# Altium schematic sheet Main.SchDoc
size A4; SheetNumber: 1; SheetTotal: 3; SPICEModelCacheVUBOQJVG: <root> / <DocumentId>VUBOQJVG</DocumentId> / <CacheFrame Number="0"> / <Model Name="led1" Kind="MDL"> / <Text>*Typ RED GaAs LED: Vf=1.7V Vr=4V If=40mA trr=3uS / *LED Pinout: 1=A, 2=K / .MODEL LED1 D (IS=93.2P RS=42M N=3.73 BV=4 IBV=10U / + CJO=2.97P VJ=.75 M=.333 TT=4.32U)</Text> / </Model> / </CacheFrame> / </root>
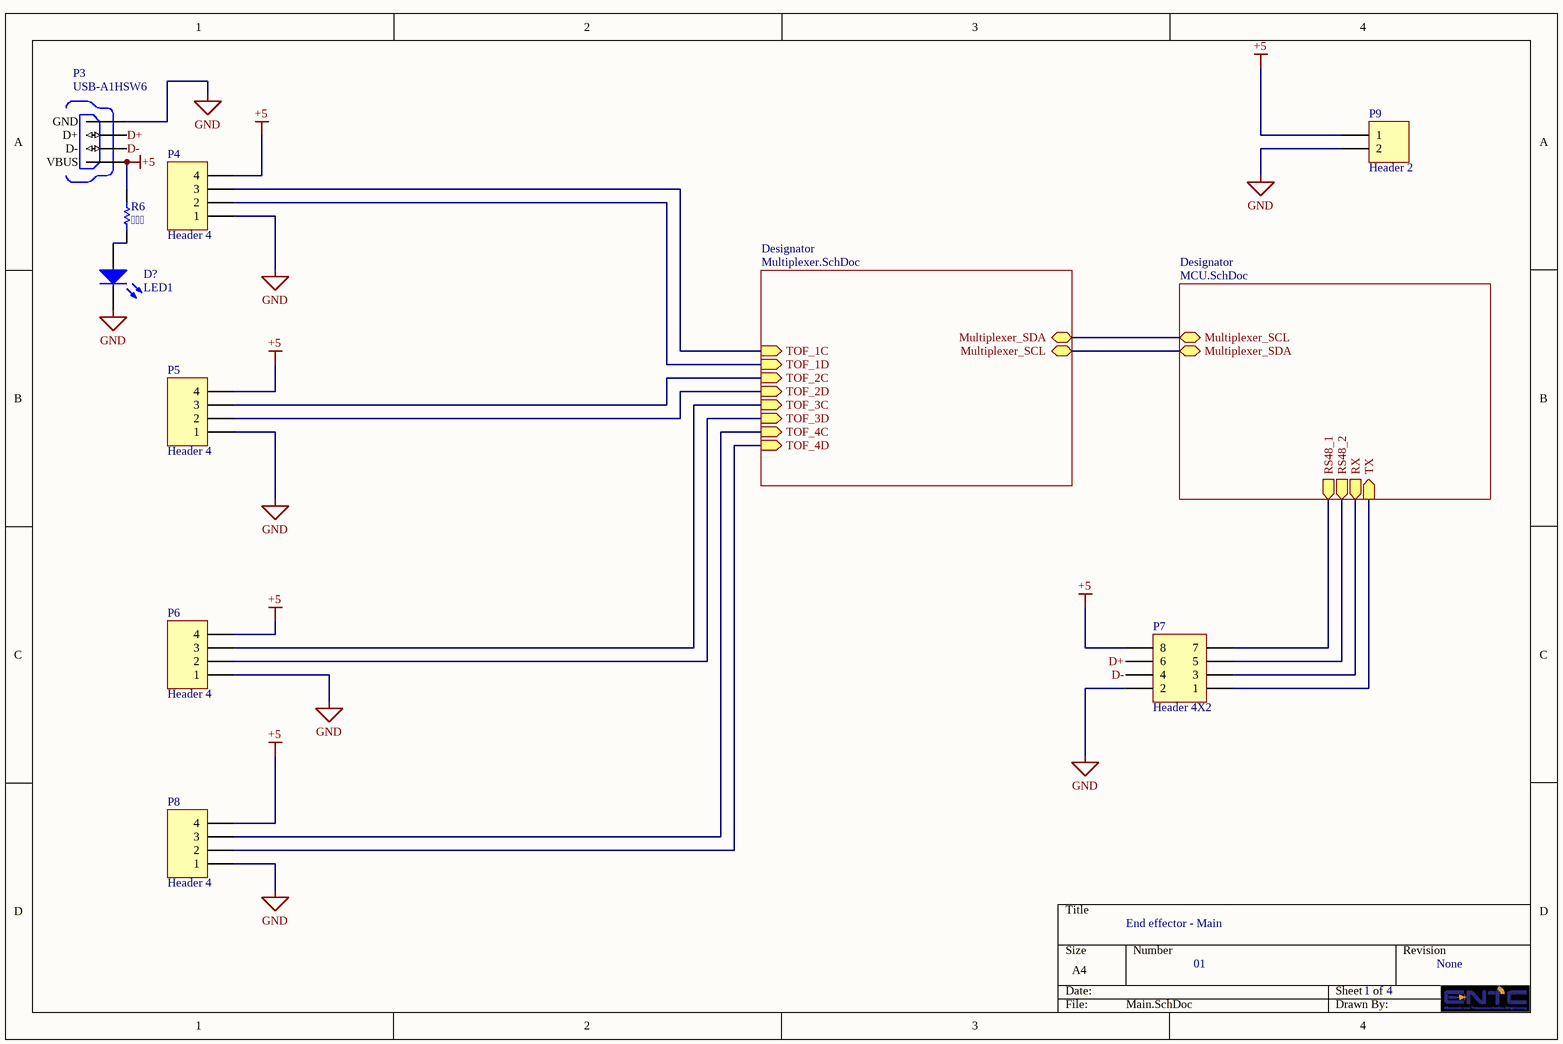
[diagram p0: Main.SchDoc]

## Parts
D?  LED1  [LED-1]
P3  USB-A1HSW6  [OST_USB-A1HSW6]
P4  Header 4  [HDR1X4]
P5  Header 4  [HDR1X4]
P6  Header 4  [HDR1X4]
P7  Header 4X2  [HDR2X4]
P8  Header 4  [HDR1X4]
P9  Header 2  [HDR1X2]
R6    [RESC2013X60X35ML10T20]

## Sub-sheets
Designator = MCU.SchDoc: Multiplexer_SCL (bidir), Multiplexer_SDA (bidir), RS48_1 (out), RS48_2 (out), TX (in), RX (out)
Designator = Multiplexer.SchDoc: Multiplexer_SDA (bidir), Multiplexer_SCL (bidir), TOF_1C (in), TOF_1D (in), TOF_2C (in), TOF_2D (in), TOF_3C (in), TOF_3D (in), TOF_4C (in), TOF_4D (in)

## Nets
+5: P3.1(VBUS) P4.4 P5.4 P6.4 P7.8 P8.4 P9.1 R6.2
GND: D?.2(K) P3.4(GND) P4.1 P5.1 P6.1 P7.2 P8.1 P9.2
D+: P3.3(D+) P7.6
D-: P3.2(D-) P7.4
NetD?_1: D?.1(A) R6.1
NetP4_2: P4.2 ; sheet Designator/TOF_1D
NetP4_3: P4.3 ; sheet Designator/TOF_1C
NetP5_2: P5.2 ; sheet Designator/TOF_2D
NetP5_3: P5.3 ; sheet Designator/TOF_2C
NetP6_2: P6.2 ; sheet Designator/TOF_3D
NetP6_3: P6.3 ; sheet Designator/TOF_3C
NetP7_1: P7.1 ; sheet Designator/TX
NetP7_3: P7.3 ; sheet Designator/RX
NetP7_5: P7.5 ; sheet Designator/RS48_2
NetP7_7: P7.7 ; sheet Designator/RS48_1
NetP8_2: P8.2 ; sheet Designator/TOF_4D
NetP8_3: P8.3 ; sheet Designator/TOF_4C
(unnamed): sheet Designator/Multiplexer_SCL, sheet Designator/Multiplexer_SDA
(unnamed): sheet Designator/Multiplexer_SDA, sheet Designator/Multiplexer_SCL

## Notes on the sheet
- End effector - Main
- 01
- 1
- 4
- None

## Library data of the parts
D? = LED1: Typical RED GaAs LED; Published: 8-Jun-2000; LatestRevisionDate: 08-Jul-2005; LatestRevisionNote: Mech Layer 1 removed.; PackageReference: LED-1; Publisher: Altium Limited; PackageDescription: LED; 2 Leads
P3 = USB-A1HSW6: USB-A (USB TYPE-A) - Receptacle Connector 4 Position Through Hole, Right Angle; MF: On Shore; Value: *; SnapEDA_Link: https://www.snapeda.com/parts/USB-A1HSW6/On+Shore+Technology+Inc./view-part/?ref=snap; Purchase-URL: https://pricing.snapeda.com/search/part/USB-A1HSW6/?ref=eda; Availability: In Stock; Price: None; Package: None; Check_prices: https://www.snapeda.com/parts/USB-A1HSW6/On+Shore+Technology+Inc./view-part/?ref=eda; MP: USB-A1HSW6
P4-P6 P8 = Header 4: Header, 4-Pin; LatestRevisionDate: 17-Jul-2002; LatestRevisionNote: Re-released for DXP Platform.; Publisher: Altium Limited
P7 = Header 4X2: Header, 4-Pin, Dual row; LatestRevisionDate: 17-Jul-2002; LatestRevisionNote: Re-released for DXP Platform.; Publisher: Altium Limited
P9 = Header 2: Header, 2-Pin; LatestRevisionDate: 17-Jul-2002; LatestRevisionNote: Re-released for DXP Platform.; Publisher: Altium Limited
R6 = CMP-2100-03673-1: Chip Resistor, 0 Ohm, Jumper, +/- 5%, 0.125 W, -55 to 155 degC, 0805 (2012 Metric), RoHS, Tape and Reel; Manufacturer: Yageo; Power Rating: 125mW; Resistance: 0mOhm; Voltage Rating (DC): 150V; Temperature Coefficient: 200ppm/degreesC; Height: 0.5mm; Depth: 1.25mm; Case Code (Imperial): 0805; Lead Free: LeadFree; Military Standard: Not; Package Description: 2-Pin Surface Mounted Device, Body 2 x 1.25 mm; Case Code (Metric): 2012; Composition: ThickFilm; Voltage Rating: 150V; Manufacturer URL: http://www.yageo.com/; Packaging: TapeandReel; Package Reference: 0805; REACH SVHC: Unknown; Tolerance: 5%; Case/Package: 0805; Max Operating Temperature: 155degC; Number of Pins: 2; Min Operating Temperature: -55degC; RoHSCompliant: true; Length: 2mm; Datasheet URL: http://www.yageo.com/NewPortal/yageodocoutput?fileName=/pdf/R-Chip/PYu-RC_Group_51_RoHS_L_5.pdf; Termination: SMD/SMT; Radiation Hardening: No; Width: 1.25mm; Contact Plating: Tin; Datasheet Version: Rev. 5, 10/2016